# Altium schematic sheet mcu.SchDoc
size A4
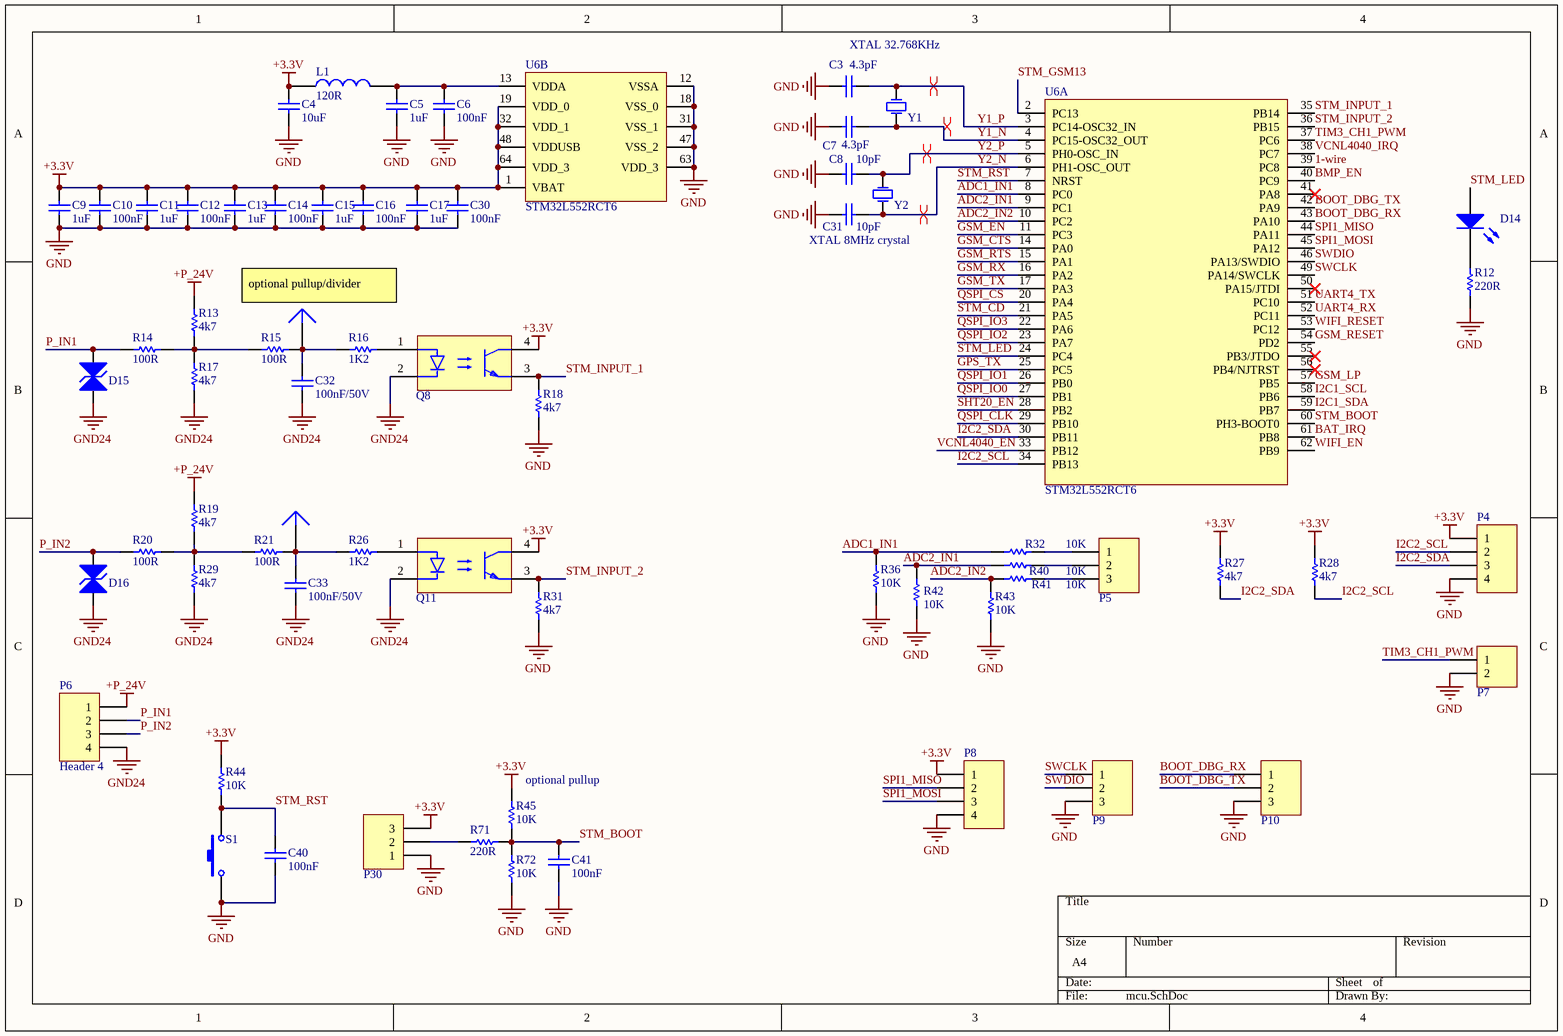
[diagram p0: mcu.SchDoc]

## Parts
C3  value 4.3pF  [C0402]  (hidden comment: Cap 4.3pF)
C4  value 10uF  [C0402]  (hidden comment: Cap 10uF)
C5  value 1uF  [C0402]  (hidden comment: Cap 1uF)
C6  value 100nF  [C0402]  (hidden comment: Cap 100nF)
C7  value 4.3pF  [C0402]  (hidden comment: Cap 4.3pF)
C8  value 10pF  [C0402]  (hidden comment: Cap 10pF)
C9  value 1uF  [C0402]  (hidden comment: Cap 1uF)
C10  value 100nF  [C0402]  (hidden comment: Cap 100nF)
C11  value 1uF  [C0402]  (hidden comment: Cap 1uF)
C12  value 100nF  [C0402]  (hidden comment: Cap 100nF)
C13  value 1uF  [C0402]  (hidden comment: Cap 1uF)
C14  value 100nF  [C0402]  (hidden comment: Cap 100nF)
C15  value 1uF  [C0402]  (hidden comment: Cap 1uF)
C16  value 100nF  [C0402]  (hidden comment: Cap 100nF)
C17  value 1uF  [C0402]  (hidden comment: Cap 1uF)
C30  value 100nF  [C0402]  (hidden comment: Cap 100nF)
C31  value 10pF  [C0402]  (hidden comment: Cap 10pF)
C32  value 100nF/50V  [C1206]  (hidden comment: Cap 100nF/50V)
C33  value 100nF/50V  [C1206]  (hidden comment: Cap 100nF/50V)
C40  value 100nF  [C0402]  (hidden comment: Cap 100nF)
C41  value 100nF  [C0402]  (hidden comment: Cap 100nF)
D14  LED  [0603LedRed]  (value not drawn)
D15  TVS Bidirectional  [SMA]  (value not drawn)
D16  TVS Bidirectional  [SMA]  (value not drawn)
L1  120R  [0805FerriteBead]
P4  Header 4  [HDR1X4]  (value not drawn)
P5  Header 3  [HDR1X3]  (value not drawn)
P6  Header 4  [HDR1X4]
P7  Header 2  [HDR1X2]  (value not drawn)
P8  Header 4  [HDR1X4]  (value not drawn)
P9  Header 3  [HDR1X3]  (value not drawn)
P10  Header 3  [HDR1X3]  (value not drawn)
P23  Plug  [pin smd]  (value not drawn)  (no BOM)
P24  Plug  [pin smd]  (value not drawn)  (no BOM)
P30  Header 3  [HDR1X3]  (value not drawn)
Q8  TLP291  [SO4]  (value not drawn)
Q11  TLP291  [SO4]  (value not drawn)
R12  value 220R  [R0402]  (hidden comment: Res_220R)
R13  value 4k7  [R0805]  (hidden comment: Res_4k7)
R14  value 100R  [R0805]  (hidden comment: Res_100R)
R15  value 100R  [R0805]  (hidden comment: Res_100R)
R16  value 1K2  [R0805]  (hidden comment: Res_1K2)
R17  value 4k7  [R0805]  (hidden comment: Res_4k7)
R18  value 4k7  [R0402]  (hidden comment: Res_4k7)
R19  value 4k7  [R0805]  (hidden comment: Res_4k7)
R20  value 100R  [R0805]  (hidden comment: Res_100R)
R21  value 100R  [R0805]  (hidden comment: Res_100R)
R26  value 1K2  [R0805]  (hidden comment: Res_1K2)
R27  value 4k7  [R0402]  (hidden comment: Res_4k7)
R28  value 4k7  [R0402]  (hidden comment: Res_4k7)
R29  value 4k7  [R0805]  (hidden comment: Res_4k7)
R31  value 4k7  [R0402]  (hidden comment: Res_4k7)
R32  value 10K  [R0402]  (hidden comment: Res_10K)
R36  value 10K  [R0402]  (hidden comment: Res_10K)
R40  value 10K  [R0402]  (hidden comment: Res_10K)
R41  value 10K  [R0402]  (hidden comment: Res_10K)
R42  value 10K  [R0402]  (hidden comment: Res_10K)
R43  value 10K  [R0402]  (hidden comment: Res_10K)
R44  value 10K  [R0402]  (hidden comment: Res_10K)
R45  value 10K  [R0402]  (hidden comment: Res_10K)
R71  value 220R  [R0402]  (hidden comment: Res_220R)
R72  value 10K  [R0402]  (hidden comment: Res_10K)
S1  switch  [TACK SWITCH 2-PAD]  (value not drawn)
U6  STM32L552RCT6  [LQFP64]  (parts A,B of 2)
Y1  XTAL 32.768KHz  [XTAL_FC-13A]
Y2  XTAL 8MHz crystal  [XTAL500X320X120]

## Nets
+3.3V: C4.2 C9.2 C10.1 C11.2 C12.1 C13.2 C14.1 C15.2 C16.1 C17.2 C30.1 L1.1 P4.1 P8.1 P30.3 Q8.4(C) Q11.4(C) R27.2 R28.2 R44.2 R45.2 U6.1(VBAT) U6.19(VDD_0) U6.32(VDD_1) U6.48(VDDUSB) U6.64(VDD_3)
+P_24V: P6.1 R13.2 R19.2
GND: C3.2 C4.1 C5.1 C6.2 C7.2 C8.2 C9.1 C10.2 C11.1 C12.2 C13.1 C14.2 C15.1 C16.2 C17.1 C30.2 C31.2 C40.1 C41.1 P4.4 P7.2 P8.4 P9.3 P10.3 P30.1 R12.1 R18.1 R31.1 R36.1 R42.1 R43.1 R72.1 S1.1 U6.12(VSSA) U6.18(VSS_0) U6.31(VSS_1) U6.47(VSS_2) U6.63(VDD_3)
GND24: C32.1 C33.1 D15.1 D16.1 P6.4 Q8.2(C) Q11.2(C) R17.1 R29.1
1-wire: U6.39(PC8)
ADC1_IN1: R32.1 R36.2 U6.8(PC0)
ADC2_IN1: R40.1 R42.2 U6.9(PC1)
ADC2_IN2: R41.1 R43.2 U6.10(PC2)
BAT_IRQ: U6.61(PB8)
BMP_EN: U6.40(PC9)
BOOT_DBG_RX: P10.1 U6.43(PA10)
BOOT_DBG_TX: P10.2 U6.42(PA9)
GPS_TX: U6.25(PC5)
GSM_CTS: U6.14(PA0)
GSM_EN: U6.11(PC3)
GSM_LP: U6.57(PB5)
GSM_RESET: U6.54(PD2)
GSM_RTS: U6.15(PA1)
GSM_RX: U6.16(PA2)
GSM_TX: U6.17(PA3)
I2C1_SCL: U6.58(PB6)
I2C1_SDA: U6.59(PB7)
I2C2_SCL: P4.2 R28.1 U6.34(PB13)
I2C2_SDA: P4.3 R27.1 U6.30(PB11)
P_IN1: D15.2 P6.2 R14.1
P_IN2: D16.2 P6.3 R20.1
QSPI_CLK: U6.29(PB10)
QSPI_CS: U6.20(PA4)
QSPI_IO0: U6.27(PB1)
QSPI_IO1: U6.26(PB0)
QSPI_IO2: U6.23(PA7)
QSPI_IO3: U6.22(PA6)
SHT20_EN: U6.28(PB2)
SPI1_MISO: P8.2 U6.44(PA11)
SPI1_MOSI: P8.3 U6.45(PA12)
STM_BOOT: C41.2 R45.1 R71.2 R72.2 U6.60(PH3-BOOT0)
STM_CD: U6.21(PA5)
STM_GSM13: U6.2(PC13)
STM_INPUT_1: Q8.3(E) R18.2 U6.35(PB14)
STM_INPUT_2: Q11.3(E) R31.2 U6.36(PB15)
STM_LED: D14.1(A) U6.24(PC4)
STM_RST: C40.2 R44.1 S1.2 U6.7(NRST)
SWCLK: P9.1 U6.49(PA14/SWCLK)
SWDIO: P9.2 U6.46(PA13/SWDIO)
TIM3_CH1_PWM: P7.1 U6.37(PC6)
UART4_RX: U6.52(PC11)
UART4_TX: U6.51(PC10)
VCNL4040_EN: U6.33(PB12)
VCNL4040_IRQ: U6.38(PC7)
WIFI_EN: U6.62(PB9)
WIFI_RESET: U6.53(PC12)
Y1_N: C7.1 U6.4(PC15-OSC32_OUT) Y1.1(OSC1)
Y1_P: C3.1 U6.3(PC14-OSC32_IN) Y1.2(OSC2)
Y2_N: C31.1 U6.6(PH1-OSC_OUT) Y2.1(OSC1)
Y2_P: C8.1 U6.5(PH0-OSC_IN) Y2.2(OSC2)
NetC5_2: C5.2 C6.1 L1.2 U6.13(VDDA)
NetC32_2: C32.2 P23.1 R15.2 R16.1
NetC33_2: C33.2 P24.1 R21.2 R26.1
NetD14_2: D14.2(K) R12.2
NetP5_1: P5.1 R32.2
NetP5_2: P5.2 R40.2
NetP5_3: P5.3 R41.2
NetP30_2: P30.2 R71.1
NetQ8_1: Q8.1(A) R16.2
NetQ11_1: Q11.1(A) R26.2
NetR13_1: R13.1 R14.2 R15.1 R17.2
NetR19_1: R19.1 R20.2 R21.1 R29.2

Not connected (* = marked no-connect by the designer): U6 41(PA8)* 50(PA15/JTDI)* 55(PB3/JTDO)* 56(PB4/NJTRST)*

## Layout directives
differential pair: Y1_N, Y1_P, Y2_N, Y2_P

## Notes on the sheet
- (near P23) optional pullup/divider
- (near R45) optional pullup

## Library data of the parts
C3 C7 = Cap 4.3pF: Capacitor
C4 = Cap 10uF: Capacitor
C5 C9 C11 C13 C15 C17 = Cap 1uF: Capacitor
C6 C10 C12 C14 C16 C30 C40 C41 = Cap 100nF: Capacitor
C8 C31 = Cap 10pF: Capacitor
C32 C33 = Cap 100nF/50V: Capacitor
D14 = LED: Typical RED GaAs LED; Published: 8-Jun-2000; LatestRevisionDate: 08-Jul-2005; LatestRevisionNote: Mech Layer 1 removed.; PackageReference: LED-1; Publisher: Altium Limited; PackageDescription: LED; 2 Leads
D15 D16 = TVS_bidirectional: SMAJ40CA; Published: 8-Jun-2000; LatestRevisionDate: 17-Jul-2002; LatestRevisionNote: Re-released for DXP Platform.; PackageReference: DIODE-0.7; Publisher: Altium Limited; PackageDescription: Diode, Thru-Hole; 2 Leads; 0.7 in Pin Spacing; ComponentLink1Description: datasheet; ComponentLink1URL: https://datasheet.lcsc.com/szlcsc/1912111437_Jiangsu-JieJie-Microelectronics-SMAJ40CA_C364660.pdf
L1 = Ferrite bead 120R: Ferrite bead; Value: 10mH; Published: 24-Mar-1999; LatestRevisionDate: 17-Jul-2002; LatestRevisionNote: Re-released for DXP Platform.; PackageReference: AXIAL-0.9; Publisher: Altium Limited; PackageDescription: Axial Device, Thru-Hole; 2 Leads; 0.9 in Pin Spacing; ComponentLink1Description: Ferrite bead TDK MMZ2012Y300B; ComponentLink1URL: https://www.tme.eu/pl/details/mmz2012y300b/ferryty-koraliki/tdk/
P4 P6 P8 = Header 4: Header, 4-Pin; LatestRevisionDate: 17-Jul-2002; LatestRevisionNote: Re-released for DXP Platform.; Publisher: Altium Limited
P5 P9 P10 P30 = Header 3: Header, 3-Pin; LatestRevisionDate: 17-Jul-2002; LatestRevisionNote: Re-released for DXP Platform.; Publisher: Altium Limited
P7 = Header 2: Header, 2-Pin; LatestRevisionDate: 17-Jul-2002; LatestRevisionNote: Re-released for DXP Platform.; Publisher: Altium Limited
Q8 Q11 = TLP291: OPTO  TLP291; ComponentLink1Description: datasheet; ComponentLink1URL: https://datasheet.lcsc.com/szlcsc/TOSHIBA-TLP291-GB-TP-SE-T_C55144.pdf
R12 R71 = Res_220R: Resistor
R13 R17-R19 R27-R29 R31 = Res_4k7: Resistor
R14 R15 R20 R21 = Res_100R: Resistor
R16 R26 = Res_1K2: Resistor
R32 R36 R40-R45 R72 = Res_10K: Resistor
U6 = STM32L552RCT6: Arm Cortex-M33 with Trust Zone, MCU 110 MHz with 512K Flash 256K Ram memory LQFP64; Manufacturer: STMicroelectronics; PartNumber: STM32L152CCU6; D/A Converter: 2x12-bit (2 Channel); Data E2PROM nom (B): 8192; Display controller: LCD 4x18; FLASH Size (Prog) (kB): 256; I/Os (High Current): 37; Internal RAM Size (kB): 32; Packing: Tray; Supply Voltage(Vcc) min (V): 1.65; DatasheetVersion: Rev. 3; PackageVersion: Rev. 1, 04/2013; PackageReference: UFQFPN48; PackageDescription: 48-Pin Ultra Thin Fine Pitch Quad Flat No-Lead, 7 x 7 x 0.6 mm Body, 0.5 mm Pitch, Exposed Pad; Core: ARM Cortex-M3; Operating Frequency(F) (Processor speed) (MHz): 32; Mounting Technology: Surface Mount; ComponentLink2Description: Mouser; ComponentLink2URL: https://pl.mouser.com/ProductDetail/STMicroelectronics/STM32L552RCT6?qs=sGAEpiMZZMto2ohCYbAIUUJm%252BzcpS0IxFbqkp9%2F0sPoEpVjys%2Fepxg%3D%3D
Y1 = XTAL 32.768KHz: XTAL 32.768KHz crystal; value: 8MHz; Published: 8-Jun-2000; LatestRevisionDate: 17-Jul-2002; LatestRevisionNote: Re-released for DXP Platform.; Publisher: Altium Limited; ComponentLink1Description: Datasheet; ComponentLink1URL: https://datasheet.lcsc.com/szlcsc/1901081604_Seiko-Epson-Q13FC1350000400_C32346.pdf
Y2 = XTAL 8MHz: TXC Corp 7A08000001; Published: 8-Jun-2000; LatestRevisionDate: 17-Jul-2002; LatestRevisionNote: Re-released for DXP Platform.; Publisher: Altium Limited; ComponentLink1Description: Datasheet; ComponentLink1URL: http://www.txccorp.com/download/products/quartz_crystals/2015TXC_7A_28.pdf; value: 8MHz; ComponentLink2Description: JLC; ComponentLink2URL: https://jlcpcb.com/parts/componentSearch?secondSortUuid=09f7e4779fd84e989f34c78148375bf2&name=SMD%20Crystal%20Resonators&firstSortUuid=6771ff6d5925444e85b2121d008b3ccd
P23 P24 = Plug: LatestRevisionDate: 17-Jul-2002; LatestRevisionNote: Re-released for DXP Platform.; Publisher: Altium Limited
S1 = switch: Published: 24-Mar-1999; LatestRevisionDate: 17-Jul-2002; LatestRevisionNote: Re-released for DXP Platform.; PackageReference: SPST-2; Publisher: Altium Limited; PackageDescription: Switch; 2 Leads